# EAGLE schematic 5V AC-DC Regulator (EAGLE 9.6.2)
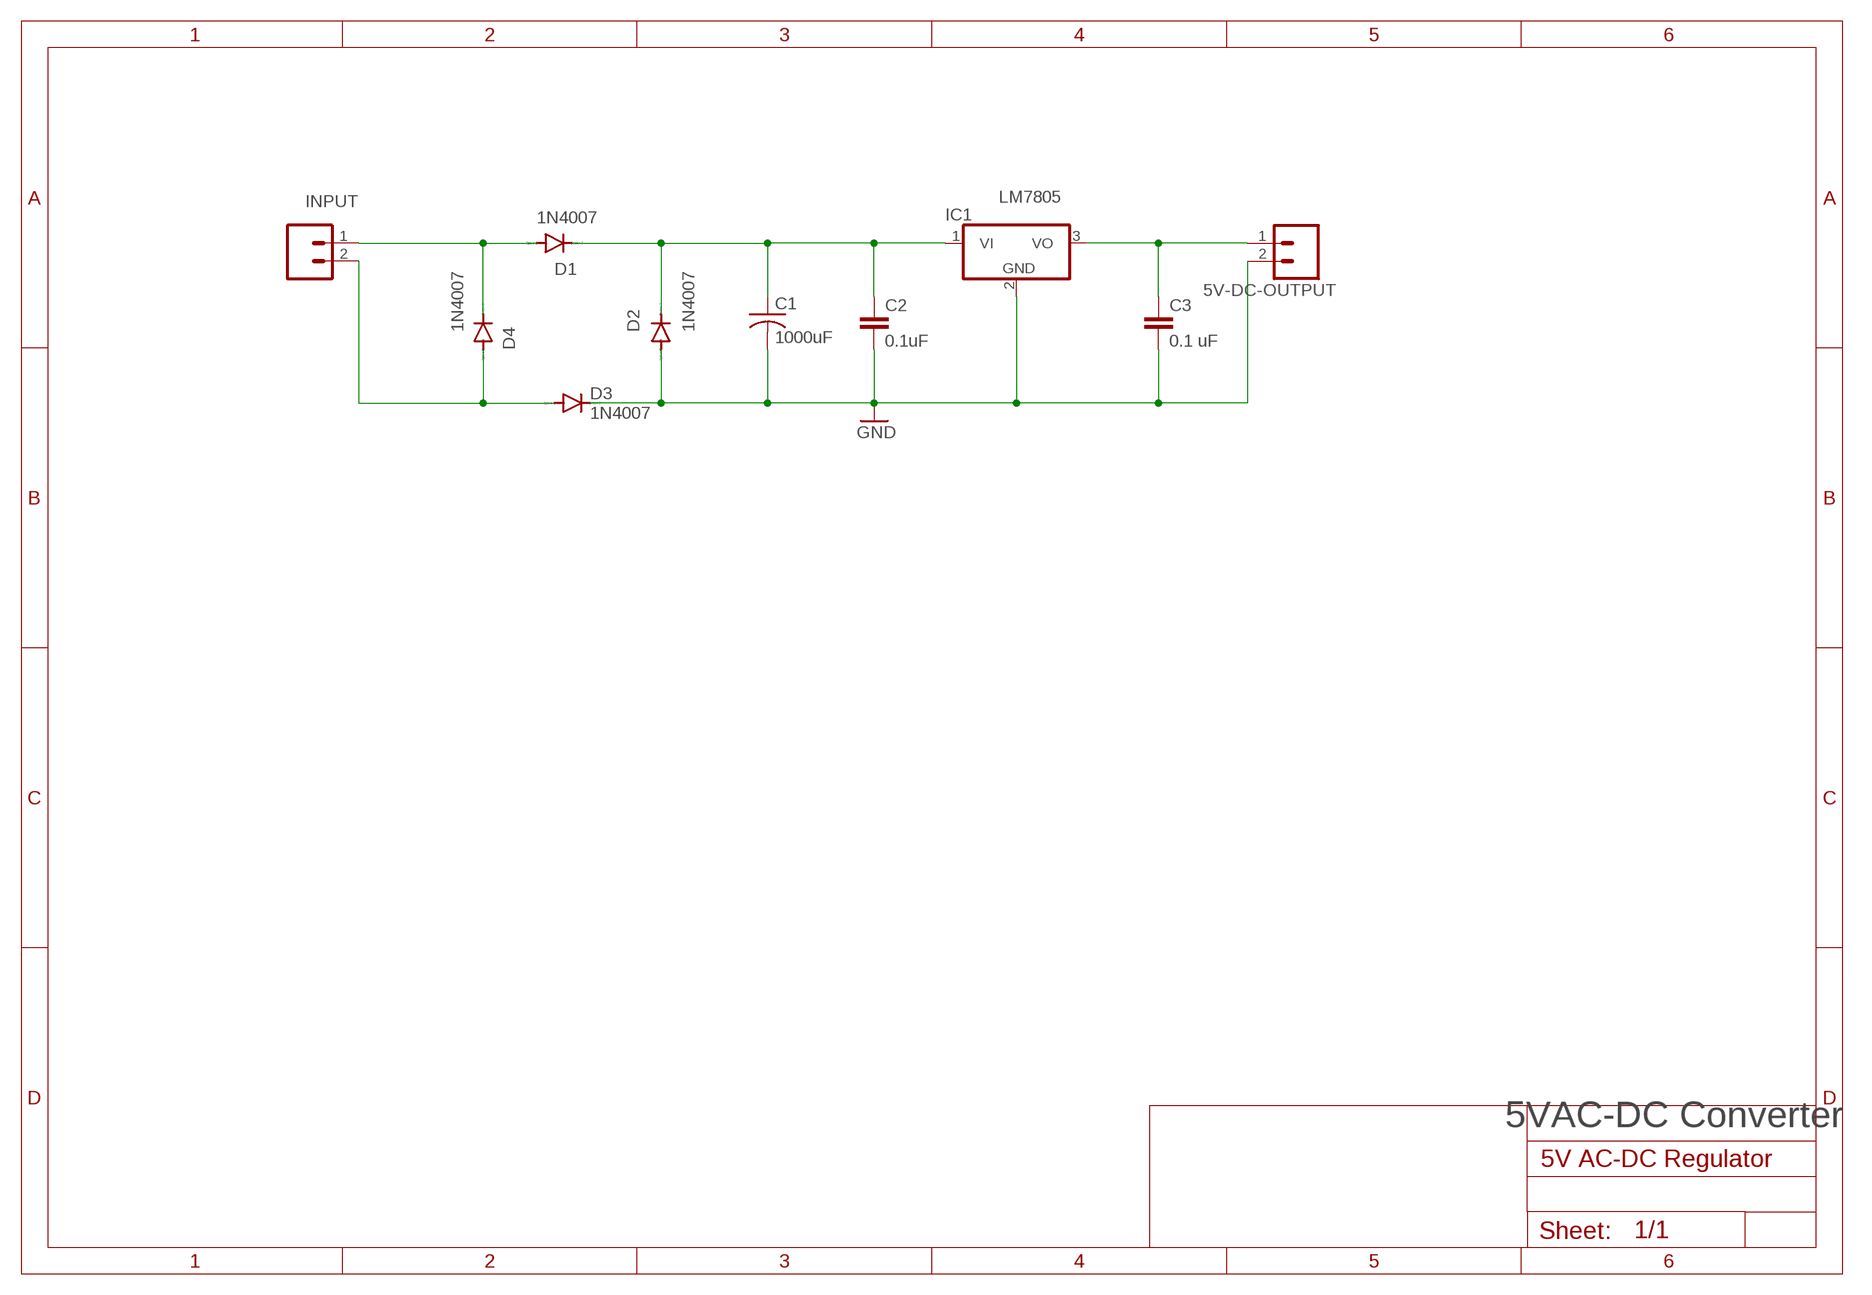
[diagram p0: schematic, sheet 1]

## Parts
5V-DC-OUTPUT  M02  [02P]
C1  1000uF  C-US025-024X044  [C025-024X044]
C2  0.1uF  C-EU025-025X050  [C025-025X050]
C3  0.1 uF  C-EU025-025X050  [C025-025X050]
D1  1N4007  1N4004  [DO41-10]
D2  1N4007  1N4004  [DO41-10]
D3  1N4007  1N4004  [DO41-10]
D4  1N4007  1N4004  [DO41-10]
IC1  LM7805  786TV  [TO220V]
INPUT  M02  [02P]

## Nets
GND: 5V-DC-OUTPUT.2 C1.2 C2.2 C3.2 D2.A D3.C IC1.2(GND)
N$1: D1.A D4.C INPUT.1
N$2: C1.1 C2.1 D1.C D2.C IC1.1(VI)
N$3: D3.A D4.A INPUT.2
N$5: 5V-DC-OUTPUT.1 C3.1 IC1.3(VO)

## Notes on the sheet
- 5VAC-DC Converter

## Library data of the parts
5V-DC-OUTPUT INPUT = con-amp-quick:M02: AMP QUICK CONNECTOR; OC_FARNELL: unknown; OC_NEWARK: unknown
C1 = rcl:C-US: CAPACITOR, American symbol; SPICEPREFIX: C
C2 C3 = rcl:C-EU: CAPACITOR, European symbol; SPICEPREFIX: C
D1-D4 = diode:1N4004: DIODE general purpose rectifier, 1 A
IC1 = linear:78*: Positive VOLTAGE REGULATOR Source: http://cache.national.com/ds/LM/LM78L05.pdf http://www.fairchildsemi.com/ds/LM/LM7805.pdf